# Altium schematic sheet ADS.SchDoc
size A3
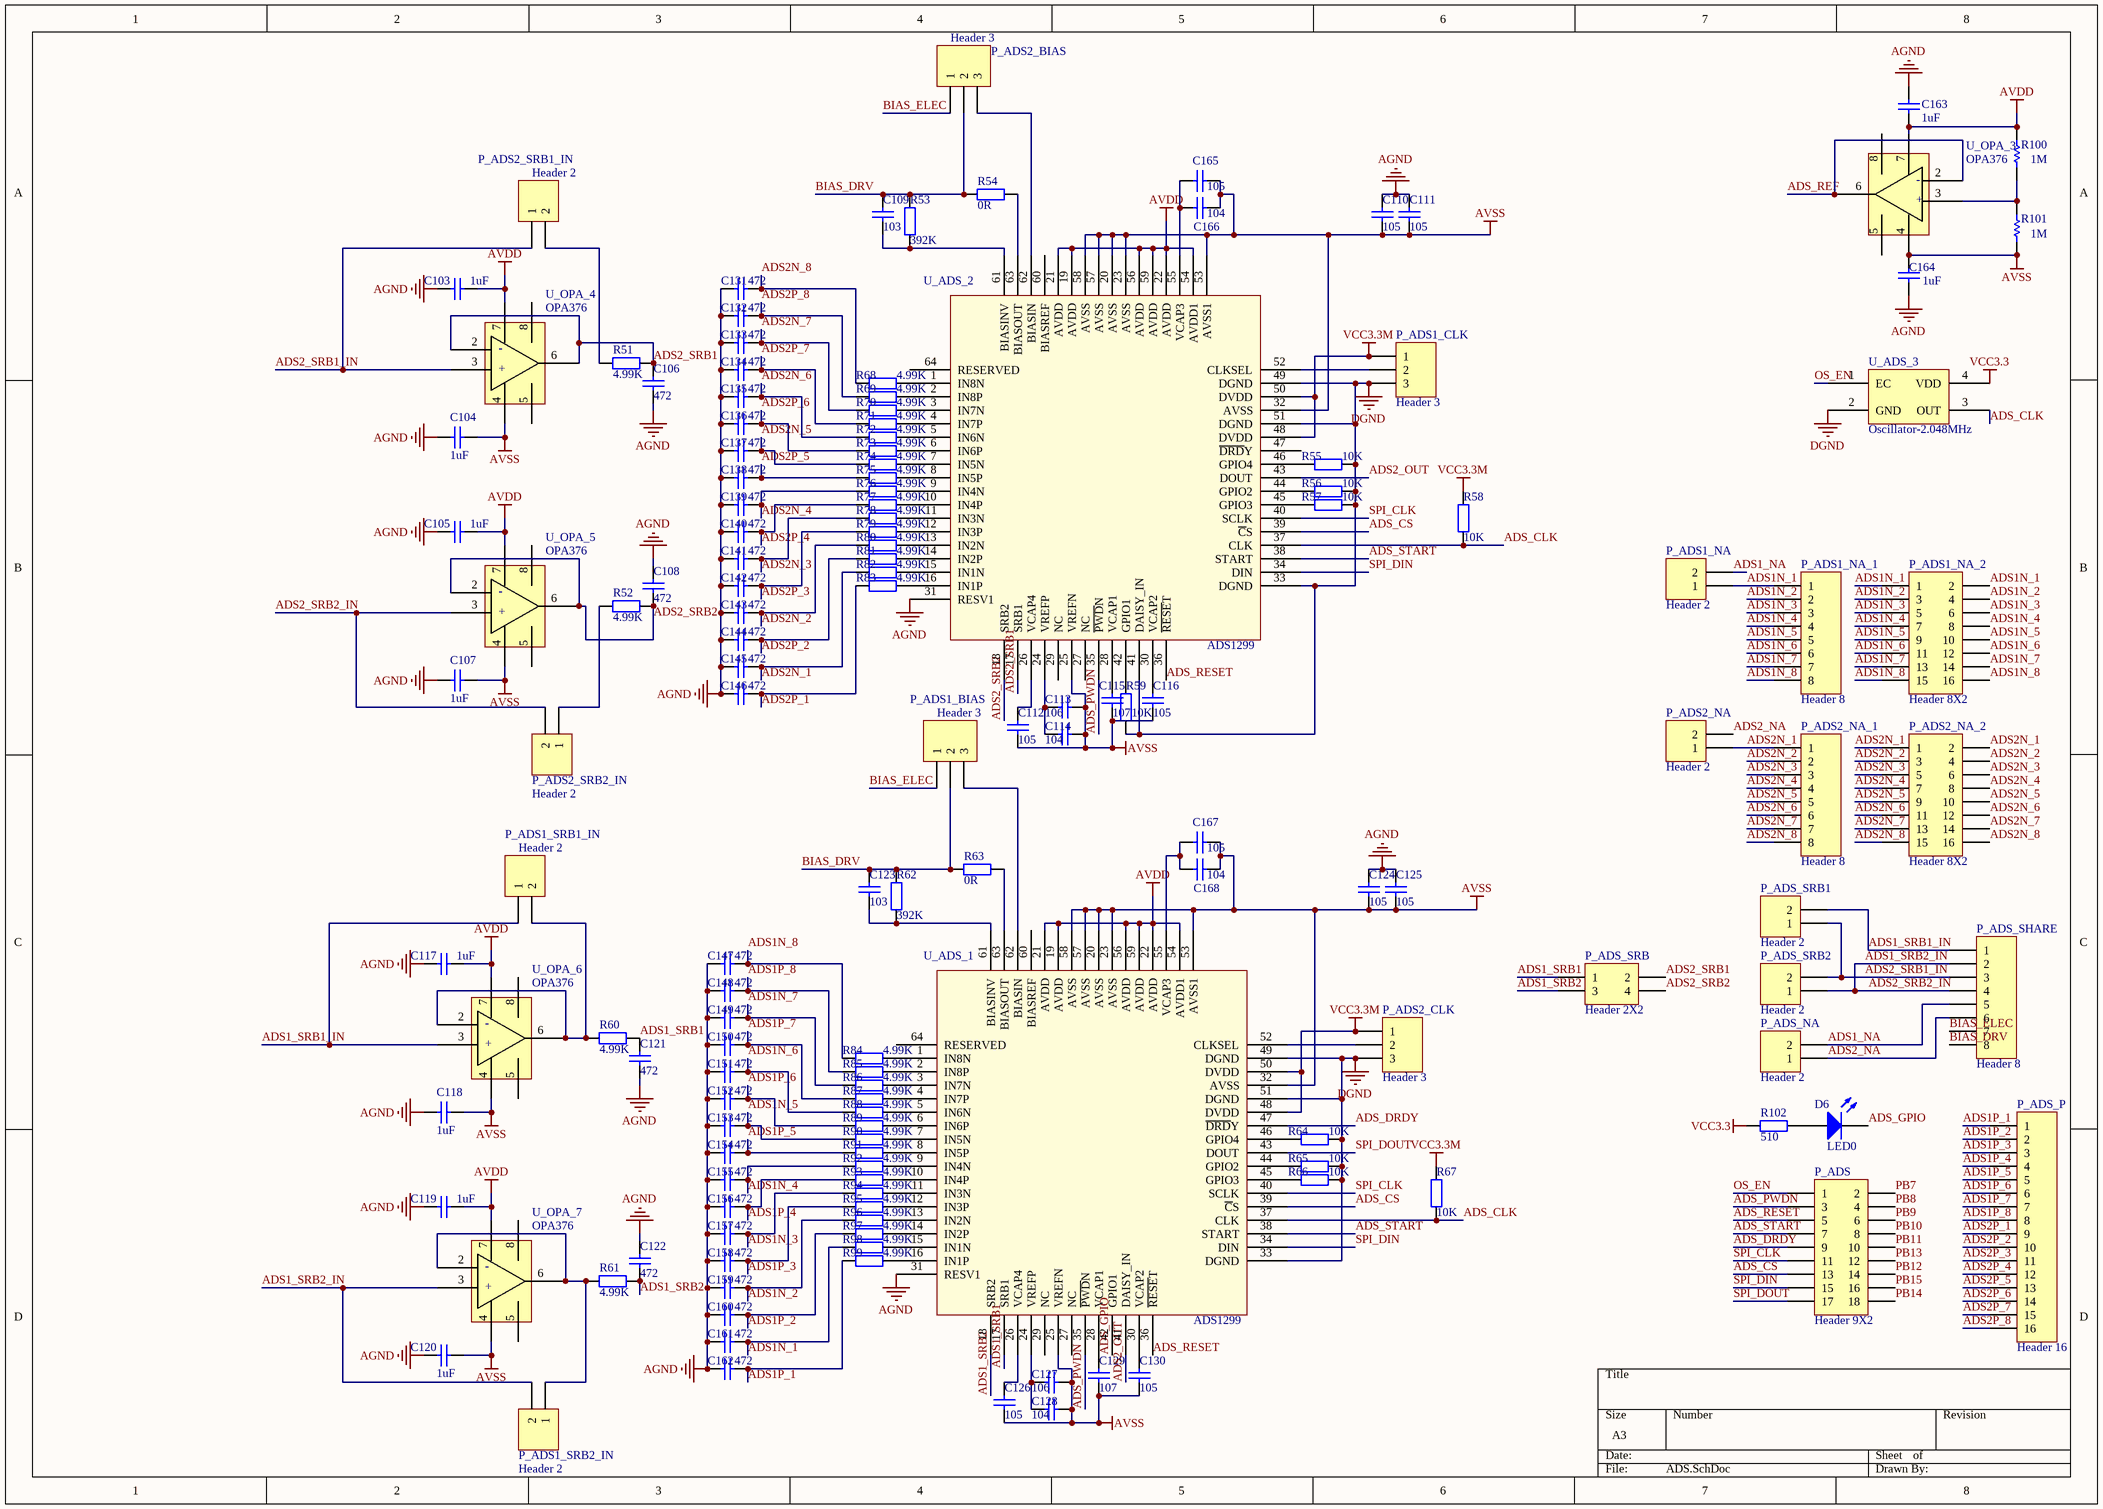
[diagram p0: ADS.SchDoc]

## Parts
C103  1uF  [SMT-0603]
C104  1uF  [SMT-0603]
C105  1uF  [SMT-0603]
C106  value 472  [SMT-0603]  (hidden comment: Cap)
C107  1uF  [SMT-0603]
C108  value 472  [SMT-0603]  (hidden comment: Cap)
C109  value 103  [SMT-0603]  (hidden comment: Cap)
C110  value 105  [SMT-0603]  (hidden comment: Cap)
C111  value 105  [SMT-0603]  (hidden comment: Cap)
C112  value 105  [SMT-0603]  (hidden comment: Cap)
C113  value 106  [SMT-0603]  (hidden comment: Cap)
C114  value 104  [SMT-0603]  (hidden comment: Cap)
C115  value 107  [SMT-0603]  (hidden comment: Cap)
C116  value 105  [SMT-0603]  (hidden comment: Cap)
C117  1uF  [SMT-0603]
C118  1uF  [SMT-0603]
C119  1uF  [SMT-0603]
C120  1uF  [SMT-0603]
C121  value 472  [SMT-0603]  (hidden comment: Cap)
C122  value 472  [SMT-0603]  (hidden comment: Cap)
C123  value 103  [SMT-0603]  (hidden comment: Cap)
C124  value 105  [SMT-0603]  (hidden comment: Cap)
C125  value 105  [SMT-0603]  (hidden comment: Cap)
C126  value 105  [SMT-0603]  (hidden comment: Cap)
C127  value 106  [SMT-0603]  (hidden comment: Cap)
C128  value 104  [SMT-0603]  (hidden comment: Cap)
C129  value 107  [SMT-0603]  (hidden comment: Cap)
C130  value 105  [SMT-0603]  (hidden comment: Cap)
C131  value 472  [SMT-0603]  (hidden comment: Cap)
C132  value 472  [SMT-0603]  (hidden comment: Cap)
C133  value 472  [SMT-0603]  (hidden comment: Cap)
C134  value 472  [SMT-0603]  (hidden comment: Cap)
C135  value 472  [SMT-0603]  (hidden comment: Cap)
C136  value 472  [SMT-0603]  (hidden comment: Cap)
C137  value 472  [SMT-0603]  (hidden comment: Cap)
C138  value 472  [SMT-0603]  (hidden comment: Cap)
C139  value 472  [SMT-0603]  (hidden comment: Cap)
C140  value 472  [SMT-0603]  (hidden comment: Cap)
C141  value 472  [SMT-0603]  (hidden comment: Cap)
C142  value 472  [SMT-0603]  (hidden comment: Cap)
C143  value 472  [SMT-0603]  (hidden comment: Cap)
C144  value 472  [SMT-0603]  (hidden comment: Cap)
C145  value 472  [SMT-0603]  (hidden comment: Cap)
C146  value 472  [SMT-0603]  (hidden comment: Cap)
C147  value 472  [SMT-0603]  (hidden comment: Cap)
C148  value 472  [SMT-0603]  (hidden comment: Cap)
C149  value 472  [SMT-0603]  (hidden comment: Cap)
C150  value 472  [SMT-0603]  (hidden comment: Cap)
C151  value 472  [SMT-0603]  (hidden comment: Cap)
C152  value 472  [SMT-0603]  (hidden comment: Cap)
C153  value 472  [SMT-0603]  (hidden comment: Cap)
C154  value 472  [SMT-0603]  (hidden comment: Cap)
C155  value 472  [SMT-0603]  (hidden comment: Cap)
C156  value 472  [SMT-0603]  (hidden comment: Cap)
C157  value 472  [SMT-0603]  (hidden comment: Cap)
C158  value 472  [SMT-0603]  (hidden comment: Cap)
C159  value 472  [SMT-0603]  (hidden comment: Cap)
C160  value 472  [SMT-0603]  (hidden comment: Cap)
C161  value 472  [SMT-0603]  (hidden comment: Cap)
C162  value 472  [SMT-0603]  (hidden comment: Cap)
C163  1uF  [SMT-0603]
C164  1uF  [SMT-0603]
C165  value 105  [SMT-0603]  (hidden comment: Cap)
C166  value 104  [SMT-0603]  (hidden comment: Cap)
C167  value 105  [SMT-0603]  (hidden comment: Cap)
C168  value 104  [SMT-0603]  (hidden comment: Cap)
D6  LED0  [K3528]
P_ADS  Header 9X2  [HDR2X9]
P_ADS1_BIAS  Header 3  [HDR1X3]
P_ADS1_CLK  Header 3  [HDR1X3]
P_ADS1_NA  Header 2  [HDR1X2]
P_ADS1_NA_1  Header 8  [HDR1X8]
P_ADS1_NA_2  Header 8X2  [HDR2X8]
P_ADS1_SRB1_IN  Header 2  [HDR1X2]
P_ADS1_SRB2_IN  Header 2  [HDR1X2]
P_ADS2_BIAS  Header 3  [HDR1X3]
P_ADS2_CLK  Header 3  [HDR1X3]
P_ADS2_NA  Header 2  [HDR1X2]
P_ADS2_NA_1  Header 8  [HDR1X8]
P_ADS2_NA_2  Header 8X2  [HDR2X8]
P_ADS2_SRB1_IN  Header 2  [HDR1X2]
P_ADS2_SRB2_IN  Header 2  [HDR1X2]
P_ADS_NA  Header 2  [HDR1X2]
P_ADS_P  Header 16  [HDR1X16]
P_ADS_SHARE  Header 8  [HDR1X8]
P_ADS_SRB  Header 2X2  [HDR2X2]
P_ADS_SRB1  Header 2  [HDR1X2]
P_ADS_SRB2  Header 2  [HDR1X2]
R51  value 4.99K  [SMT-0603]  (hidden comment: Res2)
R52  value 4.99K  [SMT-0603]  (hidden comment: Res2)
R53  value 392K  [SMT-0603]  (hidden comment: Res2)
R54  value 0R  [SMT-0603]  (hidden comment: Res2)
R55  value 10K  [SMT-0603]  (hidden comment: Res2)
R56  value 10K  [SMT-0603]  (hidden comment: Res2)
R57  value 10K  [SMT-0603]  (hidden comment: Res2)
R58  value 10K  [SMT-0603]  (hidden comment: Res2)
R59  value 10K  [SMT-0603]  (hidden comment: Res2)
R60  value 4.99K  [SMT-0603]  (hidden comment: Res2)
R61  value 4.99K  [SMT-0603]  (hidden comment: Res2)
R62  value 392K  [SMT-0603]  (hidden comment: Res2)
R63  value 0R  [SMT-0603]  (hidden comment: Res2)
R64  value 10K  [SMT-0603]  (hidden comment: Res2)
R65  value 10K  [SMT-0603]  (hidden comment: Res2)
R66  value 10K  [SMT-0603]  (hidden comment: Res2)
R67  value 10K  [SMT-0603]  (hidden comment: Res2)
R68  value 4.99K  [SMT-0603]  (hidden comment: Res2)
R69  value 4.99K  [SMT-0603]  (hidden comment: Res2)
R70  value 4.99K  [SMT-0603]  (hidden comment: Res2)
R71  value 4.99K  [SMT-0603]  (hidden comment: Res2)
R72  value 4.99K  [SMT-0603]  (hidden comment: Res2)
R73  value 4.99K  [SMT-0603]  (hidden comment: Res2)
R74  value 4.99K  [SMT-0603]  (hidden comment: Res2)
R75  value 4.99K  [SMT-0603]  (hidden comment: Res2)
R76  value 4.99K  [SMT-0603]  (hidden comment: Res2)
R77  value 4.99K  [SMT-0603]  (hidden comment: Res2)
R78  value 4.99K  [SMT-0603]  (hidden comment: Res2)
R79  value 4.99K  [SMT-0603]  (hidden comment: Res2)
R80  value 4.99K  [SMT-0603]  (hidden comment: Res2)
R81  value 4.99K  [SMT-0603]  (hidden comment: Res2)
R82  value 4.99K  [SMT-0603]  (hidden comment: Res2)
R83  value 4.99K  [SMT-0603]  (hidden comment: Res2)
R84  value 4.99K  [SMT-0603]  (hidden comment: Res2)
R85  value 4.99K  [SMT-0603]  (hidden comment: Res2)
R86  value 4.99K  [SMT-0603]  (hidden comment: Res2)
R87  value 4.99K  [SMT-0603]  (hidden comment: Res2)
R88  value 4.99K  [SMT-0603]  (hidden comment: Res2)
R89  value 4.99K  [SMT-0603]  (hidden comment: Res2)
R90  value 4.99K  [SMT-0603]  (hidden comment: Res2)
R91  value 4.99K  [SMT-0603]  (hidden comment: Res2)
R92  value 4.99K  [SMT-0603]  (hidden comment: Res2)
R93  value 4.99K  [SMT-0603]  (hidden comment: Res2)
R94  value 4.99K  [SMT-0603]  (hidden comment: Res2)
R95  value 4.99K  [SMT-0603]  (hidden comment: Res2)
R96  value 4.99K  [SMT-0603]  (hidden comment: Res2)
R97  value 4.99K  [SMT-0603]  (hidden comment: Res2)
R98  value 4.99K  [SMT-0603]  (hidden comment: Res2)
R99  value 4.99K  [SMT-0603]  (hidden comment: Res2)
R100  1M  [SMT-0603]
R101  1M  [SMT-0603]
R102  value 510  [SMT-0603]  (hidden comment: Res2)
U_ADS_1  ADS1299  [LQFP64]
U_ADS_2  ADS1299  [LQFP64]
U_ADS_3  Oscillator-2.048MHz  [3225]
U_OPA_3  OPA376  [SOP8]
U_OPA_4  OPA376  [SOP8]
U_OPA_5  OPA376  [SOP8]
U_OPA_6  OPA376  [SOP8]
U_OPA_7  OPA376  [SOP8]

## Nets
AGND: C103.2 C104.2 C105.2 C106.1 C107.2 C108.2 C110.2 C111.2 C117.2 C118.2 C119.2 C120.2 C121.1 C122.2 C124.2 C125.2 C131.1 C132.1 C133.1 C134.1 C135.1 C136.1 C137.1 C138.1 C139.1 C140.1 C141.1 C142.1 C143.1 C144.1 C145.1 C146.1 C147.1 C148.1 C149.1 C150.1 C151.1 C152.1 C153.1 C154.1 C155.1 C156.1 C157.1 C158.1 C159.1 C160.1 C161.1 C162.1 C163.2 C164.2 U_ADS_1.31(RESV1) U_ADS_2.31(RESV1)
AVDD: C103.1 C105.1 C117.1 C119.1 C163.1 R100.1 U_ADS_1.19(AVDD) U_ADS_1.21(AVDD) U_ADS_1.22(AVDD) U_ADS_1.54(AVDD1) U_ADS_1.56(AVDD) U_ADS_1.59(AVDD) U_ADS_2.19(AVDD) U_ADS_2.21(AVDD) U_ADS_2.22(AVDD) U_ADS_2.54(AVDD1) U_ADS_2.56(AVDD) U_ADS_2.59(AVDD) U_OPA_3.7 U_OPA_4.7 U_OPA_5.7 U_OPA_6.7 U_OPA_7.7
AVSS: C104.1 C107.1 C110.1 C111.1 C112.1 C113.2 C114.2 C115.1 C116.1 C118.1 C120.1 C124.1 C125.1 C126.1 C127.2 C128.2 C129.1 C130.1 C164.1 C165.2 C166.2 C167.2 C168.2 R101.2 U_ADS_1.20(AVSS) U_ADS_1.23(AVSS) U_ADS_1.25(VREFN) U_ADS_1.32(AVSS) U_ADS_1.53(AVSS1) U_ADS_1.57(AVSS) U_ADS_1.58(AVSS) U_ADS_2.20(AVSS) U_ADS_2.23(AVSS) U_ADS_2.25(VREFN) U_ADS_2.32(AVSS) U_ADS_2.53(AVSS1) U_ADS_2.57(AVSS) U_ADS_2.58(AVSS) U_OPA_3.4 U_OPA_4.4 U_OPA_5.4 U_OPA_6.4 U_OPA_7.4
DGND: P_ADS1_CLK.3 P_ADS2_CLK.3 R55.2 R56.2 R57.2 R59.1 R64.2 R65.2 R66.2 U_ADS_1.33(DGND) U_ADS_1.49(DGND) U_ADS_1.51(DGND) U_ADS_2.33(DGND) U_ADS_2.41(DAISY_IN) U_ADS_2.49(DGND) U_ADS_2.51(DGND) U_ADS_3.2(GND)
VCC3.3: R102.1 U_ADS_3.4(VDD)
VCC3.3M: P_ADS1_CLK.1 P_ADS2_CLK.1 R58.2 R67.2 U_ADS_1.48(DVDD) U_ADS_1.50(DVDD) U_ADS_2.48(DVDD) U_ADS_2.50(DVDD)
ADS1_NA: P_ADS1_NA.2 P_ADS_NA.2 P_ADS_SHARE.5
ADS1_SRB1: C121.2 P_ADS_SRB.1 R60.2 U_ADS_1.17(SRB1)
ADS1_SRB1_IN: P_ADS1_SRB1_IN.1 P_ADS_SHARE.1 P_ADS_SRB1.2 U_OPA_6.3
ADS1_SRB2: C122.1 P_ADS_SRB.3 R61.2 U_ADS_1.18(SRB2)
ADS1_SRB2_IN: P_ADS1_SRB2_IN.2 P_ADS2_SRB2_IN.2 P_ADS_SHARE.2 P_ADS_SHARE.4 P_ADS_SRB2.1 U_OPA_5.3 U_OPA_7.3  [also labelled ADS2_SRB2_IN]
ADS1N_1: C161.2 P_ADS1_NA.1 P_ADS1_NA_1.1 P_ADS1_NA_2.1 P_ADS1_NA_2.2 R98.1
ADS1N_2: C159.2 P_ADS1_NA_1.2 P_ADS1_NA_2.3 P_ADS1_NA_2.4 R96.1
ADS1N_3: C157.2 P_ADS1_NA_1.3 P_ADS1_NA_2.5 P_ADS1_NA_2.6 R94.1
ADS1N_4: C155.2 P_ADS1_NA_1.4 P_ADS1_NA_2.7 P_ADS1_NA_2.8 R92.1
ADS1N_5: C153.2 P_ADS1_NA_1.5 P_ADS1_NA_2.9 P_ADS1_NA_2.10 R90.1
ADS1N_6: C151.2 P_ADS1_NA_1.6 P_ADS1_NA_2.11 P_ADS1_NA_2.12 R88.1
ADS1N_7: C149.2 P_ADS1_NA_1.7 P_ADS1_NA_2.13 P_ADS1_NA_2.14 R86.1
ADS1N_8: C147.2 P_ADS1_NA_1.8 P_ADS1_NA_2.15 P_ADS1_NA_2.16 R84.1
ADS1P_1: C162.2 P_ADS_P.1 R99.1
ADS1P_2: C160.2 P_ADS_P.2 R97.1
ADS1P_3: C158.2 P_ADS_P.3 R95.1
ADS1P_4: C156.2 P_ADS_P.4 R93.1
ADS1P_5: C154.2 P_ADS_P.5 R91.1
ADS1P_6: C152.2 P_ADS_P.6 R89.1
ADS1P_7: C150.2 P_ADS_P.7 R87.1
ADS1P_8: C148.2 P_ADS_P.8 R85.1
ADS2_NA: P_ADS2_NA.2 P_ADS_NA.1 P_ADS_SHARE.6
ADS2_OUT: U_ADS_1.41(DAISY_IN) U_ADS_2.43(DOUT)
ADS2_SRB1: C106.2 P_ADS_SRB.2 R51.2 U_ADS_2.17(SRB1) U_OPA_4.2 U_OPA_4.6
ADS2_SRB1_IN: P_ADS2_SRB1_IN.1 P_ADS_SHARE.3 P_ADS_SRB1.1 P_ADS_SRB2.2 U_OPA_4.3
ADS2_SRB2: C108.1 P_ADS_SRB.4 R52.2 U_ADS_2.18(SRB2) U_OPA_5.2 U_OPA_5.6
ADS2N_1: C145.2 P_ADS2_NA.1 P_ADS2_NA_1.1 P_ADS2_NA_2.1 P_ADS2_NA_2.2 R82.1
ADS2N_2: C143.2 P_ADS2_NA_1.2 P_ADS2_NA_2.3 P_ADS2_NA_2.4 R80.1
ADS2N_3: C141.2 P_ADS2_NA_1.3 P_ADS2_NA_2.5 P_ADS2_NA_2.6 R78.1
ADS2N_4: C139.2 P_ADS2_NA_1.4 P_ADS2_NA_2.7 P_ADS2_NA_2.8 R76.1
ADS2N_5: C137.2 P_ADS2_NA_1.5 P_ADS2_NA_2.9 P_ADS2_NA_2.10 R74.1
ADS2N_6: C135.2 P_ADS2_NA_1.6 P_ADS2_NA_2.11 P_ADS2_NA_2.12 R72.1
ADS2N_7: C133.2 P_ADS2_NA_1.7 P_ADS2_NA_2.13 P_ADS2_NA_2.14 R70.1
ADS2N_8: C131.2 P_ADS2_NA_1.8 P_ADS2_NA_2.15 P_ADS2_NA_2.16 R68.1
ADS2P_1: C146.2 P_ADS_P.9 R83.1
ADS2P_2: C144.2 P_ADS_P.10 R81.1
ADS2P_3: C142.2 P_ADS_P.11 R79.1
ADS2P_4: C140.2 P_ADS_P.12 R77.1
ADS2P_5: C138.2 P_ADS_P.13 R75.1
ADS2P_6: C136.2 P_ADS_P.14 R73.1
ADS2P_7: C134.2 P_ADS_P.15 R71.1
ADS2P_8: C132.2 P_ADS_P.16 R69.1
ADS_CLK: R58.1 R67.1 U_ADS_1.37(CLK) U_ADS_2.37(CLK) U_ADS_3.3(OUT)
ADS_CS: P_ADS.13 U_ADS_1.39(~{C}S) U_ADS_2.39(~{C}S)
ADS_DRDY: P_ADS.9 U_ADS_1.47(~{DRD}Y)
ADS_GPIO: D6.2(K) U_ADS_1.42(GPIO1)
ADS_PWDN: P_ADS.3 U_ADS_1.35(~{PWD}N) U_ADS_2.35(~{PWD}N)
ADS_REF: U_OPA_3.2 U_OPA_3.6
ADS_RESET: P_ADS.5 U_ADS_1.36(~{RESE}T) U_ADS_2.36(~{RESE}T)
ADS_START: P_ADS.7 U_ADS_1.38(START) U_ADS_2.38(START)
BIAS_DRV: C109.2 C123.2 P_ADS1_BIAS.2 P_ADS2_BIAS.2 P_ADS_SHARE.8 R53.2 R54.1 R62.2 R63.1
BIAS_ELEC: P_ADS1_BIAS.1 P_ADS2_BIAS.1 P_ADS_SHARE.7
OS_EN: P_ADS.1 U_ADS_3.1(EC)
PB7: P_ADS.2
PB8: P_ADS.4
PB9: P_ADS.6
PB10: P_ADS.8
PB11: P_ADS.10
PB12: P_ADS.14
PB13: P_ADS.12
PB14: P_ADS.18
PB15: P_ADS.16
SPI_CLK: P_ADS.11 U_ADS_1.40(SCLK) U_ADS_2.40(SCLK)
SPI_DIN: P_ADS.15 U_ADS_1.34(DIN) U_ADS_2.34(DIN)
SPI_DOUT: P_ADS.17 U_ADS_1.43(DOUT)
NetC109_1: C109.1 R53.1 U_ADS_2.61(BIASINV)
NetC112_2: C112.2 U_ADS_2.26(VCAP4)
NetC113_1: C113.1 C114.1 U_ADS_2.24(VREFP)
NetC115_2: C115.2 U_ADS_2.28(VCAP1)
NetC116_2: C116.2 U_ADS_2.30(VCAP2)
NetC123_1: C123.1 R62.1 U_ADS_1.61(BIASINV)
NetC126_2: C126.2 U_ADS_1.26(VCAP4)
NetC127_1: C127.1 C128.1 U_ADS_1.24(VREFP)
NetC129_2: C129.2 U_ADS_1.28(VCAP1)
NetC130_2: C130.2 U_ADS_1.30(VCAP2)
NetC165_1: C165.1 C166.1 U_ADS_2.55(VCAP3)
NetC167_1: C167.1 C168.1 U_ADS_1.55(VCAP3)
NetD6_1: D6.1(A) R102.2
NetP_ADS1_BIAS_3: P_ADS1_BIAS.3 U_ADS_1.62(BIASIN)
NetP_ADS1_CLK_2: P_ADS1_CLK.2 U_ADS_2.52(CLKSEL)
NetP_ADS1_SRB1_IN_2: P_ADS1_SRB1_IN.2 R60.1 U_OPA_6.2 U_OPA_6.6
NetP_ADS1_SRB2_IN_1: P_ADS1_SRB2_IN.1 R61.1 U_OPA_7.2 U_OPA_7.6
NetP_ADS2_BIAS_3: P_ADS2_BIAS.3 U_ADS_2.62(BIASIN)
NetP_ADS2_CLK_2: P_ADS2_CLK.2 U_ADS_1.52(CLKSEL)
NetP_ADS2_SRB1_IN_2: P_ADS2_SRB1_IN.2 R51.1
NetP_ADS2_SRB2_IN_1: P_ADS2_SRB2_IN.1 R52.1
NetR54_2: R54.2 U_ADS_2.63(BIASOUT)
NetR55_1: R55.1 U_ADS_2.46(GPIO4)
NetR56_1: R56.1 U_ADS_2.44(GPIO2)
NetR57_1: R57.1 U_ADS_2.45(GPIO3)
NetR59_2: R59.2 U_ADS_2.42(GPIO1)
NetR63_2: R63.2 U_ADS_1.63(BIASOUT)
NetR64_1: R64.1 U_ADS_1.46(GPIO4)
NetR65_1: R65.1 U_ADS_1.44(GPIO2)
NetR66_1: R66.1 U_ADS_1.45(GPIO3)
NetR68_2: R68.2 U_ADS_2.1(IN8N)
NetR69_2: R69.2 U_ADS_2.2(IN8P)
NetR70_2: R70.2 U_ADS_2.3(IN7N)
NetR71_2: R71.2 U_ADS_2.4(IN7P)
NetR72_2: R72.2 U_ADS_2.5(IN6N)
NetR73_2: R73.2 U_ADS_2.6(IN6P)
NetR74_2: R74.2 U_ADS_2.7(IN5N)
NetR75_2: R75.2 U_ADS_2.8(IN5P)
NetR76_2: R76.2 U_ADS_2.9(IN4N)
NetR77_2: R77.2 U_ADS_2.10(IN4P)
NetR78_2: R78.2 U_ADS_2.11(IN3N)
NetR79_2: R79.2 U_ADS_2.12(IN3P)
NetR80_2: R80.2 U_ADS_2.13(IN2N)
NetR81_2: R81.2 U_ADS_2.14(IN2P)
NetR82_2: R82.2 U_ADS_2.15(IN1N)
NetR83_2: R83.2 U_ADS_2.16(IN1P)
NetR84_2: R84.2 U_ADS_1.1(IN8N)
NetR85_2: R85.2 U_ADS_1.2(IN8P)
NetR86_2: R86.2 U_ADS_1.3(IN7N)
NetR87_2: R87.2 U_ADS_1.4(IN7P)
NetR88_2: R88.2 U_ADS_1.5(IN6N)
NetR89_2: R89.2 U_ADS_1.6(IN6P)
NetR90_2: R90.2 U_ADS_1.7(IN5N)
NetR91_2: R91.2 U_ADS_1.8(IN5P)
NetR92_2: R92.2 U_ADS_1.9(IN4N)
NetR93_2: R93.2 U_ADS_1.10(IN4P)
NetR94_2: R94.2 U_ADS_1.11(IN3N)
NetR95_2: R95.2 U_ADS_1.12(IN3P)
NetR96_2: R96.2 U_ADS_1.13(IN2N)
NetR97_2: R97.2 U_ADS_1.14(IN2P)
NetR98_2: R98.2 U_ADS_1.15(IN1N)
NetR99_2: R99.2 U_ADS_1.16(IN1P)
NetR100_2: R100.2 R101.1 U_OPA_3.3

Not connected (* = marked no-connect by the designer): U_ADS_1 27(NC) 29(NC) 60(BIASREF) 64(RESERVED); U_ADS_2 27(NC) 29(NC) 47(~{DRD}Y) 60(BIASREF) 64(RESERVED); U_OPA_3 5 8; U_OPA_4 5 8; U_OPA_5 5 8; U_OPA_6 5 8; U_OPA_7 5 8

## Notes on the sheet
- (in symbol OPA376) -; +

## Library data of the parts
C103-C168 = Cap: Capacitor; Published: 8-Jun-2000; LatestRevisionDate: 17-Jul-2002; LatestRevisionNote: Re-released for DXP Platform.; PackageReference: RAD-0.3; Publisher: Altium Limited
  C103-C105 C107 C117-C120 C163 C164: Value: 1uF
  C106 C108-C116 C121-C162 C165-C168: PackageDescription: Radial Cap, Thru-Hole; 2 Leads; 0.3 in Pin Spacing
D6 = LED0: Typical INFRARED GaAs LED; Published: 8-Jun-2000; Revision: July-2002: Re-released for DXP Platform.; Publisher: Altium Limited
P_ADS = Header 9X2: Header, 9-Pin, Dual row; LatestRevisionDate: 17-Jul-2002; LatestRevisionNote: Re-released for DXP Platform.; Publisher: Altium Limited
P_ADS1_BIAS P_ADS1_CLK P_ADS2_BIAS P_ADS2_CLK = Header 3: Header, 3-Pin; LatestRevisionDate: 17-Jul-2002; LatestRevisionNote: Re-released for DXP Platform.; Publisher: Altium Limited
P_ADS1_NA P_ADS1_SRB1_IN P_ADS1_SRB2_IN P_ADS2_NA P_ADS2_SRB1_IN P_ADS2_SRB2_IN P_ADS_NA P_ADS_SRB1 P_ADS_SRB2 = Header 2: Header, 2-Pin; LatestRevisionDate: 17-Jul-2002; LatestRevisionNote: Re-released for DXP Platform.; Publisher: Altium Limited
P_ADS1_NA_1 P_ADS2_NA_1 P_ADS_SHARE = Header 8: Header, 8-Pin; LatestRevisionDate: 17-Jul-2002; LatestRevisionNote: Re-released for DXP Platform.; Publisher: Altium Limited
P_ADS1_NA_2 P_ADS2_NA_2 = Header 8X2: Header, 8-Pin, Dual row; LatestRevisionDate: 17-Jul-2002; LatestRevisionNote: Re-released for DXP Platform.; Publisher: Altium Limited
P_ADS_P = Header 16: Header, 16-Pin; LatestRevisionDate: 17-Jul-2002; LatestRevisionNote: Re-released for DXP Platform.; Publisher: Altium Limited
P_ADS_SRB = Header 2X2: Header, 2-Pin, Dual row; LatestRevisionDate: 17-Jul-2002; LatestRevisionNote: Re-released for DXP Platform.; Publisher: Altium Limited
R51-R99 R102 = Res2: Resistor; Published: 8-Jun-2000; LatestRevisionDate: 17-Jul-2002; LatestRevisionNote: Re-released for DXP Platform.; PackageReference: AXIAL-0.4; Publisher: Altium Limited; PackageDescription: Axial Device, Thru-Hole; 2 Leads; 0.4 in Pin Spacing
R100 R101 = Res1: Resistor; Published: 8-Jun-2000; LatestRevisionDate: 17-Jul-2002; LatestRevisionNote: Re-released for DXP Platform.; PackageReference: AXIAL-0.3; Publisher: Altium Limited; Value: 1M